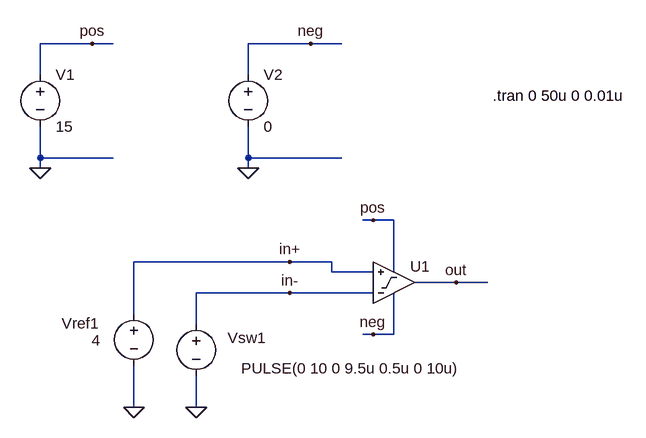
[diagram p0: schematic MyComparator Test.asc]
MyComparator Test.asc, the LTspice schematic file:
Version 4
SHEET 1 976 680
WIRE -48 -320 -128 -320
WIRE -16 -320 -48 -320
WIRE 288 -320 192 -320
WIRE 336 -320 288 -320
WIRE -128 -272 -128 -320
WIRE 192 -272 192 -320
WIRE -128 -144 -128 -192
WIRE -16 -144 -128 -144
WIRE 192 -144 192 -192
WIRE 336 -144 192 -144
WIRE -128 -128 -128 -144
WIRE 192 -128 192 -144
WIRE 384 -48 368 -48
WIRE 416 -48 384 -48
WIRE 256 16 16 16
WIRE 320 16 256 16
WIRE 320 32 320 16
WIRE 384 32 320 32
WIRE 416 32 416 -48
WIRE 512 48 448 48
WIRE 560 48 512 48
WIRE 256 64 112 64
WIRE 384 64 256 64
WIRE 16 96 16 16
WIRE 112 112 112 64
WIRE 384 128 368 128
WIRE 416 128 416 64
WIRE 416 128 384 128
WIRE 16 240 16 176
WIRE 112 240 112 192
FLAG 16 240 0
FLAG 112 240 0
FLAG 256 16 in+
FLAG 256 64 in-
FLAG -128 -128 0
FLAG 192 -128 0
FLAG -48 -320 pos
FLAG 288 -320 neg
FLAG 384 -48 pos
FLAG 384 128 neg
FLAG 512 48 out
SYMBOL voltage 112 96 M0
WINDOW 123 0 0 Left 0
WINDOW 39 0 0 Left 0
WINDOW 3 -407 84 Left 2
WINDOW 0 -107 37 Left 2
SYMATTR Value PULSE(0 10 0 9.5u 0.5u 0 10u)
SYMATTR InstName Vsw1
SYMBOL voltage 16 80 M0
WINDOW 123 0 0 Left 0
WINDOW 39 0 0 Left 0
WINDOW 0 53 31 Left 2
WINDOW 3 51 57 Left 2
SYMATTR InstName Vref1
SYMATTR Value 4
SYMBOL voltage -128 -288 R0
WINDOW 123 0 0 Left 0
WINDOW 39 0 0 Left 0
SYMATTR InstName V1
SYMATTR Value 15
SYMBOL voltage 192 -288 R0
WINDOW 123 0 0 Left 0
WINDOW 39 0 0 Left 0
SYMATTR InstName V2
SYMATTR Value 0
SYMBOL MyComparator 416 48 R0
SYMATTR InstName U1
TEXT 568 -240 Left 2 !.tran 0 50u 0 0.01u

The netlist it stands for:
* MyComparator Test.asc
Vsw1 in- 0 PULSE(0 10 0 9.5u 0.5u 0 10u)
Vref1 in+ 0 4
V1 pos 0 15
V2 neg 0 0
XU1 in+ in- pos neg out MyComparator  ; pins in+ in- pos neg out
.tran 0 50u 0 0.01u
.lib MyComparator.sub
.backanno
.end